# Altium project OpenFRA_V2.PrjPcb
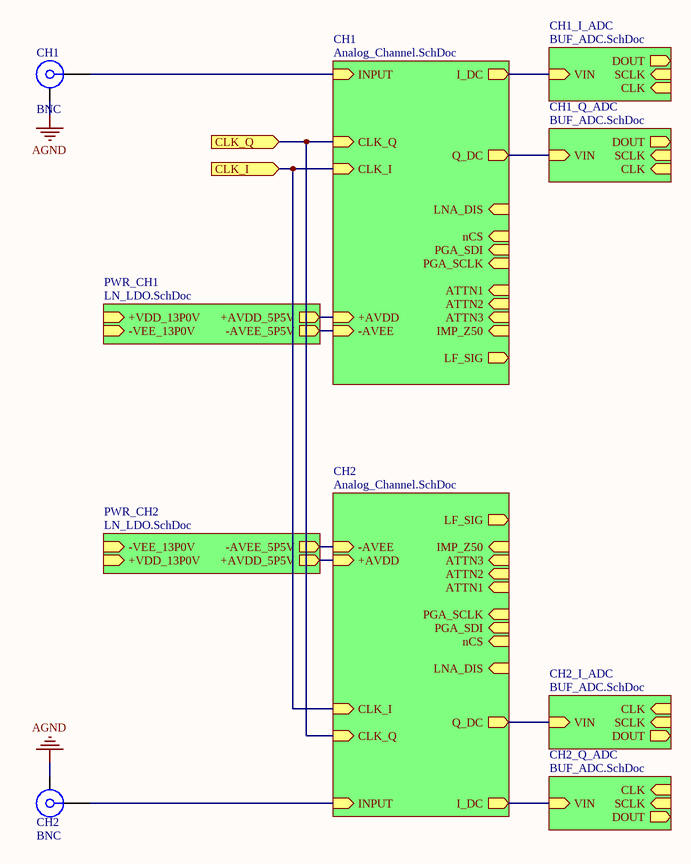
[diagram p0: Analog_Channel_Test.SchDoc]
9 sheets, 354 parts. Net scope: hierarchical (ports join the sheet entries above them; power ports are global).
Board files: PCB1.PcbDoc, PCB_AutoRoute.PcbDoc
Sheets:
  Analog_Channel_Test.SchDoc
    CH1 = Analog_Channel.SchDoc
      LNA1 = OPA847_LNA.SchDoc
      PGA1 = AD603_PGA.SchDoc
      MIXER_Q = AD834_Mixer.SchDoc
      MIXED_I = AD834_Mixer.SchDoc
      ATTN1 = Ladder_ATTN.SchDoc
    PWR_CH1 = LN_LDO.SchDoc
    CH1_I_ADC = BUF_ADC.SchDoc
    CH1_Q_ADC = BUF_ADC.SchDoc
    CH2 = Analog_Channel.SchDoc
      LNA1 = OPA847_LNA.SchDoc
      PGA1 = AD603_PGA.SchDoc
      MIXER_Q = AD834_Mixer.SchDoc
      MIXED_I = AD834_Mixer.SchDoc
      ATTN1 = Ladder_ATTN.SchDoc
    PWR_CH2 = LN_LDO.SchDoc
    CH2_Q_ADC = BUF_ADC.SchDoc
    CH2_I_ADC = BUF_ADC.SchDoc
  PCM1802_StereoADC.SchDoc

## Sheet Analog_Channel_Test.SchDoc
size A4; SheetNumber: 1; SheetTotal: 9

### Parts
CH1  BNC  [BNC-TYCO_1-1337542-0]
CH2  BNC  [BNC-TYCO_1-1337542-0]

### Sub-sheets
CH1 = Analog_Channel.SchDoc: INPUT (in), I_DC (out), Q_DC (out), CLK_Q (in), CLK_I (in), nCS (in), PGA_SDI (in), PGA_SCLK (in), LF_SIG (out), ATTN3 (in), ATTN2 (in), ATTN1 (in), IMP_Z50 (in), LNA_DIS (in), +AVDD (in), -AVEE (in)
CH1_I_ADC = BUF_ADC.SchDoc: VIN (in), CLK (in), SCLK (in), DOUT (out)
CH1_Q_ADC = BUF_ADC.SchDoc: VIN (in), CLK (in), SCLK (in), DOUT (out)
CH2 = Analog_Channel.SchDoc: INPUT (in), I_DC (out), Q_DC (out), CLK_Q (in), CLK_I (in), nCS (in), PGA_SDI (in), PGA_SCLK (in), LF_SIG (out), ATTN3 (in), ATTN2 (in), ATTN1 (in), IMP_Z50 (in), LNA_DIS (in), +AVDD (in), -AVEE (in)
CH2_I_ADC = BUF_ADC.SchDoc: VIN (in), CLK (in), SCLK (in), DOUT (out)
CH2_Q_ADC = BUF_ADC.SchDoc: VIN (in), CLK (in), SCLK (in), DOUT (out)
PWR_CH1 = LN_LDO.SchDoc: +AVDD_5P5V (out), -AVEE_5P5V (out), +VDD_13P0V (in), -VEE_13P0V (in)
PWR_CH2 = LN_LDO.SchDoc: +AVDD_5P5V (out), -AVEE_5P5V (out), +VDD_13P0V (in), -VEE_13P0V (in)

### Ports
CLK_I (in), CLK_Q (in)

### Nets
AGND: CH1.MH CH2.MH
NetC2_CH1_ATTN1_1: CH1.1 ; sheet CH1/INPUT
NetC2_CH2_ATTN1_1: CH2.1 ; sheet CH2/INPUT
NetC22_PWR_CH1_2: sheet CH1/+AVDD, sheet PWR_CH1/+AVDD_5P5V
NetC22_PWR_CH2_2: sheet CH2/+AVDD, sheet PWR_CH2/+AVDD_5P5V
NetC30_PWR_CH1_1: sheet CH1/-AVEE, sheet PWR_CH1/-AVEE_5P5V
NetC30_PWR_CH2_1: sheet CH2/-AVEE, sheet PWR_CH2/-AVEE_5P5V
NetR11_CH1_MIXED_I_1: sheet CH1/I_DC, sheet CH1_I_ADC/VIN
NetR11_CH1_MIXER_Q_1: sheet CH1/Q_DC, sheet CH1_Q_ADC/VIN
NetR11_CH2_MIXED_I_1: sheet CH2/I_DC, sheet CH2_Q_ADC/VIN
NetR11_CH2_MIXER_Q_1: sheet CH2/Q_DC, sheet CH2_I_ADC/VIN
NetU2_CH1_MIXED_I_1: port CLK_I, sheet CH1/CLK_I, sheet CH2/CLK_I
NetU2_CH1_MIXER_Q_1: port CLK_Q, sheet CH1/CLK_Q, sheet CH2/CLK_Q

### Library data of the parts
CH1 CH2 = BNC: BNC-KE PIN 6.9mm distance; PartNumber: 51K101-400A4; Design Note: Footprint in library is a generic example - only application specific footprint delivers High Performance; DatasheetVersion: c00; PackageVersion: c00; PackageReference: 51K101-400A4; PackageDescription: 50R BNC Straight Jack, 12 x 12 x 15 mm; Mounting Technology: Through Hole; ComponentLink1Description: Manufacturer URL; ComponentLink1URL: http://www.rosenberger.de; ComponentLink2Description: Datasheet; ComponentLink2URL: http://rosenberger.de/ok/images/documents/db/51K101-400A4.pdf; ComponentLink3Description: Package Specification; ComponentLink3URL: http://rosenberger.de/ok/images/documents/db/51K101-400A4.pdf; ComponentLink4Description: URL Link1; ComponentLink4URL: Series Overview / Design Note:http://rosenberger.de/ok/images/documents/spez/51.pdf; ComponentLink5Description: Webshop / RFQ; ComponentLink5URL: http://www.rosenberger.com/en/contact/sales/

## Sheet Analog_Channel.SchDoc
size A4; SheetNumber: 2; SheetTotal: 9
Used 2 times, as channels CH1, CH2. Parts and nets are listed once, with the designators drawn on the sheet.
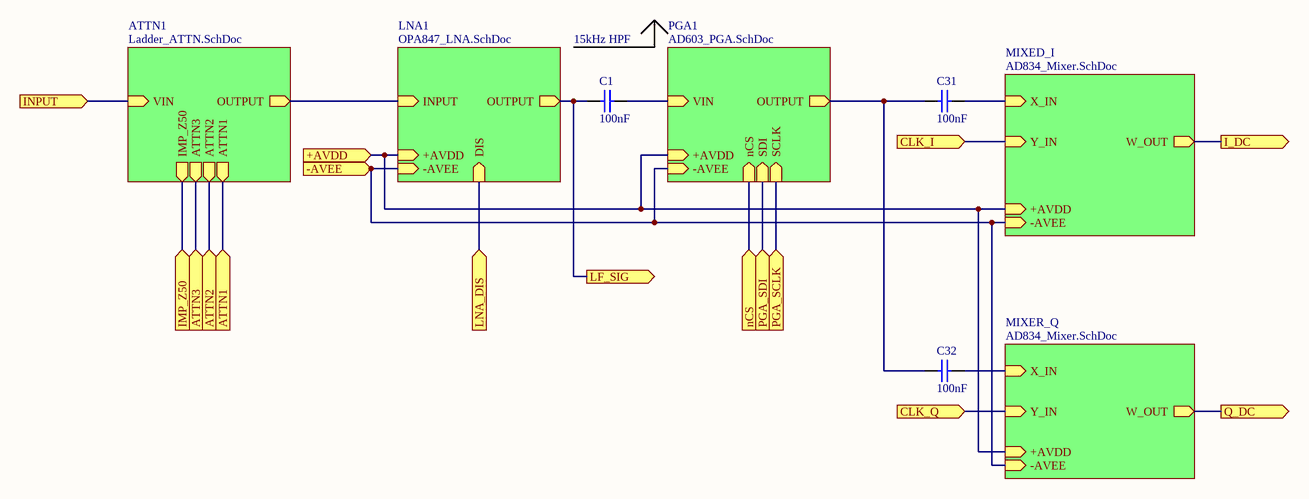
[diagram p1: Analog_Channel.SchDoc]

### Parts
C1  100nF  [0805_C]
C31  100nF  [0805_C]
C32  100nF  [0805_C]

### Sub-sheets
ATTN1 = Ladder_ATTN.SchDoc: OUTPUT (out), VIN (in), ATTN1 (out), ATTN2 (out), ATTN3 (out), IMP_Z50 (out)
LNA1 = OPA847_LNA.SchDoc: INPUT (in), OUTPUT (out), DIS (in), +AVDD (in), -AVEE (in)
MIXED_I = AD834_Mixer.SchDoc: X_IN (in), Y_IN (in), W_OUT (out), +AVDD (in), -AVEE (in)
MIXER_Q = AD834_Mixer.SchDoc: X_IN (in), Y_IN (in), W_OUT (out), +AVDD (in), -AVEE (in)
PGA1 = AD603_PGA.SchDoc: OUTPUT (out), nCS (in), SDI (in), SCLK (in), VIN (in), +AVDD (in), -AVEE (in)

### Ports
+AVDD (in), -AVEE (in), ATTN1 (in), ATTN2 (in), ATTN3 (in), CLK_I (in), CLK_Q (in), I_DC (out), IMP_Z50 (in), INPUT (in), LF_SIG (out), LNA_DIS (in), nCS (in), PGA_SCLK (in), PGA_SDI (in), Q_DC (out)

### Nets
+AVDD: port +AVDD, sheet LNA1/+AVDD, sheet PGA1/+AVDD, sheet MIXER_Q/+AVDD, sheet MIXED_I/+AVDD
-AVEE: port -AVEE, sheet LNA1/-AVEE, sheet PGA1/-AVEE, sheet MIXER_Q/-AVEE, sheet MIXED_I/-AVEE
ATTN1: port ATTN1, sheet ATTN1/ATTN1
ATTN2: port ATTN2, sheet ATTN1/ATTN2
ATTN3: port ATTN3, sheet ATTN1/ATTN3
CLK_I: port CLK_I, sheet MIXED_I/Y_IN
CLK_Q: port CLK_Q, sheet MIXER_Q/Y_IN
I_DC: port I_DC, sheet MIXED_I/W_OUT
IMP_Z50: port IMP_Z50, sheet ATTN1/IMP_Z50
INPUT: port INPUT, sheet ATTN1/VIN
LF_SIG: C1.1 ; port LF_SIG, sheet LNA1/OUTPUT
LNA_DIS: port LNA_DIS, sheet LNA1/DIS
nCS: port nCS, sheet PGA1/nCS
PGA_SCLK: port PGA_SCLK, sheet PGA1/SCLK
PGA_SDI: port PGA_SDI, sheet PGA1/SDI
Q_DC: port Q_DC, sheet MIXER_Q/W_OUT
NetC1_2: C1.2 ; sheet PGA1/VIN
NetC31_1: C31.1 C32.1 ; sheet PGA1/OUTPUT
NetC31_2: C31.2 ; sheet MIXED_I/X_IN
NetC32_2: C32.2 ; sheet MIXER_Q/X_IN
(unnamed): sheet LNA1/INPUT, sheet ATTN1/OUTPUT

### Channels
CH1: designators end in _CH1; ports +AVDD=NetC22_PWR_CH1_2 -AVEE=NetC30_PWR_CH1_1 ATTN1=NetD1_CH1_ATTN1_1 ATTN2=NetD2_CH1_ATTN1_1 ATTN3=NetD3_CH1_ATTN1_1 CLK_I=NetU2_CH1_MIXED_I_1 CLK_Q=NetU2_CH1_MIXER_Q_1 I_DC=NetR11_CH1_MIXED_I_1 IMP_Z50=NetD4_CH1_ATTN1_1 INPUT=NetC2_CH1_ATTN1_1 LF_SIG=NetC1_CH1_1 LNA_DIS=NetQ1_CH1_LNA1_1 nCS=NetR36_CH1_PGA1_1 PGA_SCLK=NetR38_CH1_PGA1_1 PGA_SDI=NetR37_CH1_PGA1_1 Q_DC=NetR11_CH1_MIXER_Q_1
CH2: designators end in _CH2; ports +AVDD=NetC22_PWR_CH2_2 -AVEE=NetC30_PWR_CH2_1 ATTN1=NetD1_CH2_ATTN1_1 ATTN2=NetD2_CH2_ATTN1_1 ATTN3=NetD3_CH2_ATTN1_1 CLK_I=NetU2_CH1_MIXED_I_1 CLK_Q=NetU2_CH1_MIXER_Q_1 I_DC=NetR11_CH2_MIXED_I_1 IMP_Z50=NetD4_CH2_ATTN1_1 INPUT=NetC2_CH2_ATTN1_1 LF_SIG=NetC1_CH2_1 LNA_DIS=NetQ1_CH2_LNA1_1 nCS=NetR36_CH2_PGA1_1 PGA_SCLK=NetR38_CH2_PGA1_1 PGA_SDI=NetR37_CH2_PGA1_1 Q_DC=NetR11_CH2_MIXER_Q_1

### Notes on the sheet
- 15kHz HPF

### Library data of the parts
C1 C31 C32 = 0805 100nF(104) 10% 50V: 贴片电容; ComponentLink1Description: 供应商链接; ComponentLink1URL: http://www.szlcsc.com/product/details_50686.html; Package: 0805; Supplier: LC; SuppliersPartNumber: C49678

## Sheet OPA847_LNA.SchDoc
size A4; SheetNumber: 3; SheetTotal: 9
Used 2 times, as channels CH1/LNA1, CH2/LNA1. Parts and nets are listed once, with the designators drawn on the sheet.
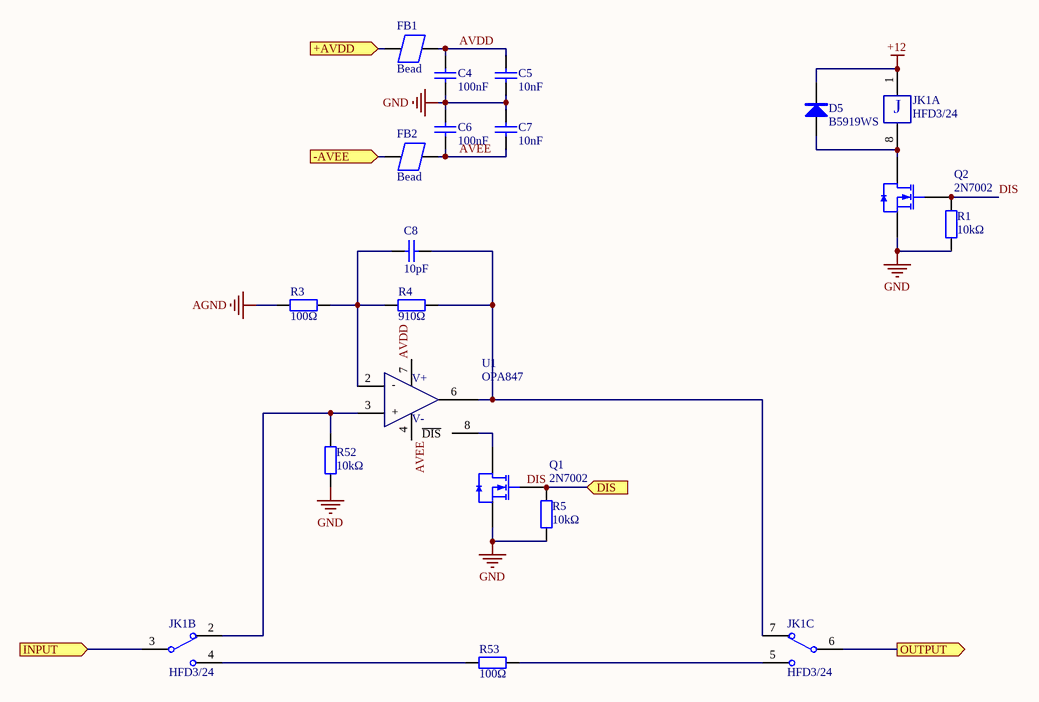
[diagram p2: OPA847_LNA.SchDoc]

### Parts
C4  100nF  [0603_C]
C5  10nF  [0603_C]
C6  100nF  [0603_C]
C7  10nF  [0603_C]
C8  10pF  [0603_C]
D5  B5919WS  [SOD-323]
FB1  Bead  [0805_L]
FB2  Bead  [0805_L]
JK1  HFD3/24  [HFD3-DIP]  (parts A,B,C of 3)
Q1  2N7002  [SOT-23(SOT-23-3)]
Q2  2N7002  [SOT-23(SOT-23-3)]
R1  10kΩ  [0603_R]
R3  100Ω  [0603_R]
R4  910Ω  [0603_R]
R5  10kΩ  [0603_R]
R52  10kΩ  [0603_R]
R53  100Ω  [0603_R]
U1  OPA847  [SOIC127P600X175-8M]

### Ports
+AVDD (in), -AVEE (in), DIS (in), INPUT (in), OUTPUT (out)

### Nets
+12: D5.2(K) JK1.1
AGND: R3.1
GND: C4.1 C5.1 C6.1 C7.1 Q1.2(S) Q2.2(S) R1.1 R5.1 R52.1
+AVDD: FB1.1 ; port +AVDD
-AVEE: FB2.1 ; port -AVEE
AVDD: C4.2 C5.2 FB1.2 U1.7(VCC+)
AVEE: C6.2 C7.2 FB2.2 U1.4(VCC-)
DIS: Q1.1(G) R5.2 ; port DIS
DIS: Q2.1(G) R1.2  [a separate net that carries the same name]
INPUT: JK1.3 ; port INPUT
OUTPUT: JK1.6 ; port OUTPUT
NetC8_1: C8.1 R3.2 R4.1 U1.2
NetC8_2: C8.2 JK1.7 R4.2 U1.6
NetD5_1: D5.1(A) JK1.8 Q2.3(D)
NetJK1_2: JK1.2 R52.2 U1.3
NetJK1_4: JK1.4 R53.2
NetJK1_5: JK1.5 R53.1
NetQ1_3: Q1.3(D) U1.8(~{DIS})

### Channels
CH1/LNA1: designators end in _CH1_LNA1; ports +AVDD=NetC22_PWR_CH1_2 -AVEE=NetC30_PWR_CH1_1 DIS=NetQ1_CH1_LNA1_1 INPUT=NetJK1_CH1_LNA1_3 OUTPUT=NetC1_CH1_1
CH2/LNA1: designators end in _CH2_LNA1; ports +AVDD=NetC22_PWR_CH2_2 -AVEE=NetC30_PWR_CH2_1 DIS=NetQ1_CH2_LNA1_1 INPUT=NetJK1_CH2_LNA1_3 OUTPUT=NetC1_CH2_1

### Notes on the sheet
- Labels drawn without touching a wire or pin: DIS
- (in symbol HFD3, part A) J
- (in symbol OPA847) V+; -; +; V-

### Library data of the parts
C4 C6 = 0603 100nF (104) 10% 50V: 贴片电容; ComponentLink1Description: 供应商链接; ComponentLink1URL: http://www.szlcsc.com/product/details_15331.html; Package: 0603; Supplier: LC; SuppliersPartNumber: C14663
C5 C7 = 0603 10nF (103) 10% 50V: 贴片电容; ComponentLink1Description: 供应商链接; ComponentLink1URL: http://www.szlcsc.com/product/details_58143.html; Package: 0603; Supplier: LC; SuppliersPartNumber: C57112
C8 = 0603 10pF (100) 5% 50V: 贴片电容; ComponentLink1Description: 供应商链接; ComponentLink1URL: http://www.szlcsc.com/product/details_1986.html; Package: 0603; Supplier: LC; SuppliersPartNumber: C1634
D5 = 1N5819: 肖特基二极管; 版权归属: 源创客; 属性: 40V/2A; BOM名称: 肖特基二极管; 学习资源: www.ooocke.com
JK1 = HFD3: 超小型两组转换; BOM名称: 两组转换继电器; 版权归属: 源创客; 学习资源: www.ooocke.com
Q1 Q2 = 2N7002 7002: MOS(场效应管); ComponentLink1Description: 供应商链接; ComponentLink1URL: http://www.szlcsc.com/product/details_9040.html; Package: SOT-23(SOT-23-3); Supplier: LC; SuppliersPartNumber: C8545
R1 R5 = 0603 10KΩ (1002) 1%: 贴片电阻; ComponentLink1Description: 供应商链接; ComponentLink1URL: http://www.szlcsc.com/product/details_26547.html; Package: 0603; Supplier: LC; SuppliersPartNumber: C25804
R3 R52 R53 = 0603 100Ω (1000) 1%: 贴片电阻; ComponentLink1Description: 供应商链接; ComponentLink1URL: http://www.szlcsc.com/product/details_23502.html; Package: 0603; Supplier: LC; SuppliersPartNumber: C22775
R4 = 0603 910Ω (9100) 1%: 贴片电阻; ComponentLink1Description: 供应商链接; ComponentLink1URL: http://www.szlcsc.com/product/details_23991.html; Package: 0603; Supplier: LC; SuppliersPartNumber: C23264
U1 = OPA847: Wideband, Ultra-Low Noise, Voltage-Feedback OPERATIONAL AMPLIFIER with Shutdown

## Sheet AD603_PGA.SchDoc
size A4; SheetNumber: 5; SheetTotal: 9
Used 2 times, as channels CH1/PGA1, CH2/PGA1. Parts and nets are listed once, with the designators drawn on the sheet.
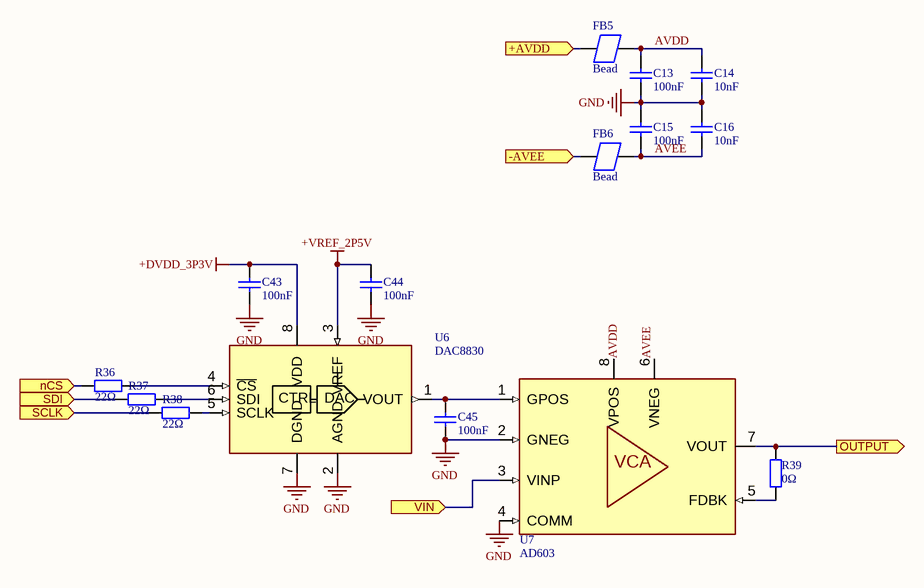
[diagram p3: AD603_PGA.SchDoc]

### Parts
C13  100nF  [0603_C]
C14  10nF  [0603_C]
C15  100nF  [0603_C]
C16  10nF  [0603_C]
C43  100nF  [0603_C]
C44  100nF  [0603_C]
C45  100nF  [0603_C]
FB5  Bead  [0805_L]
FB6  Bead  [0805_L]
R36  22Ω  [0603_R]
R37  22Ω  [0603_R]
R38  22Ω  [0603_R]
R39  0Ω  [0603_R]
U6  DAC8830  [SOIC127P600X175-8M]
U7  AD603  [SOIC127P600X175-8M]

### Ports
+AVDD (in), -AVEE (in), nCS (in), OUTPUT (out), SCLK (in), SDI (in), VIN (in)

### Nets
+DVDD_3P3V: C43.2 U6.8(VDD)
+VREF_2P5V: C44.2 U6.3(VREF)
GND: C13.1 C14.1 C15.1 C16.1 C43.1 C44.1 C45.1 U6.2(AGND) U6.7(DGND) U7.2(GNEG) U7.4(COMM)
+AVDD: FB5.1 ; port +AVDD
-AVEE: FB6.1 ; port -AVEE
AVDD: C13.2 C14.2 FB5.2
AVEE: C15.2 C16.2 FB6.2 U7.6(VNEG)
nCS: R36.1 ; port nCS
OUTPUT: R39.2 U7.7(VOUT) ; port OUTPUT
SCLK: R38.1 ; port SCLK
SDI: R37.1 ; port SDI
VIN: U7.3(VINP) ; port VIN
NetC45_2: C45.2 U6.1(VOUT) U7.1(GPOS)
NetR36_2: R36.2 U6.4(~{CS})
NetR37_2: R37.2 U6.6(SDI)
NetR38_2: R38.2 U6.5(SCLK)
NetR39_1: R39.1 U7.5(FDBK)

Not connected (* = marked no-connect by the designer): U7 8(VPOS)

### Channels
CH1/PGA1: designators end in _CH1_PGA1; ports +AVDD=NetC22_PWR_CH1_2 -AVEE=NetC30_PWR_CH1_1 nCS=NetR36_CH1_PGA1_1 OUTPUT=NetC31_CH1_1 SCLK=NetR38_CH1_PGA1_1 SDI=NetR37_CH1_PGA1_1 VIN=NetC1_CH1_2
CH2/PGA1: designators end in _CH2_PGA1; ports +AVDD=NetC22_PWR_CH2_2 -AVEE=NetC30_PWR_CH2_1 nCS=NetR36_CH2_PGA1_1 OUTPUT=NetC31_CH2_1 SCLK=NetR38_CH2_PGA1_1 SDI=NetR37_CH2_PGA1_1 VIN=NetC1_CH2_2

### Notes on the sheet
- Labels drawn without touching a wire or pin: AVDD
- (in symbol AD603) VCA
- (in symbol DAC8830) CTRL; DAC

### Library data of the parts
C13 C15 C43-C45 = 0603 100nF (104) 10% 50V: 贴片电容; ComponentLink1Description: 供应商链接; ComponentLink1URL: http://www.szlcsc.com/product/details_15331.html; Package: 0603; Supplier: LC; SuppliersPartNumber: C14663
C14 C16 = 0603 10nF (103) 10% 50V: 贴片电容; ComponentLink1Description: 供应商链接; ComponentLink1URL: http://www.szlcsc.com/product/details_58143.html; Package: 0603; Supplier: LC; SuppliersPartNumber: C57112
R36-R38 = 0603 22Ω (22R0) 1%: 贴片电阻; ComponentLink1Description: 供应商链接; ComponentLink1URL: http://www.szlcsc.com/product/details_24078.html; Package: 0603; Supplier: LC; SuppliersPartNumber: C23345
R39 = 0603 0Ω (0R0) 1%: 贴片电阻; ComponentLink1Description: 供应商链接; ComponentLink1URL: http://www.szlcsc.com/product/details_21903.html; Package: 0603; Supplier: LC; SuppliersPartNumber: C21189

## Sheet AD834_Mixer.SchDoc
size A4; SheetNumber: 4; SheetTotal: 9
Used 4 times, as channels CH1/MIXER_Q, CH1/MIXED_I, CH2/MIXER_Q, CH2/MIXED_I. Parts and nets are listed once, with the designators drawn on the sheet.
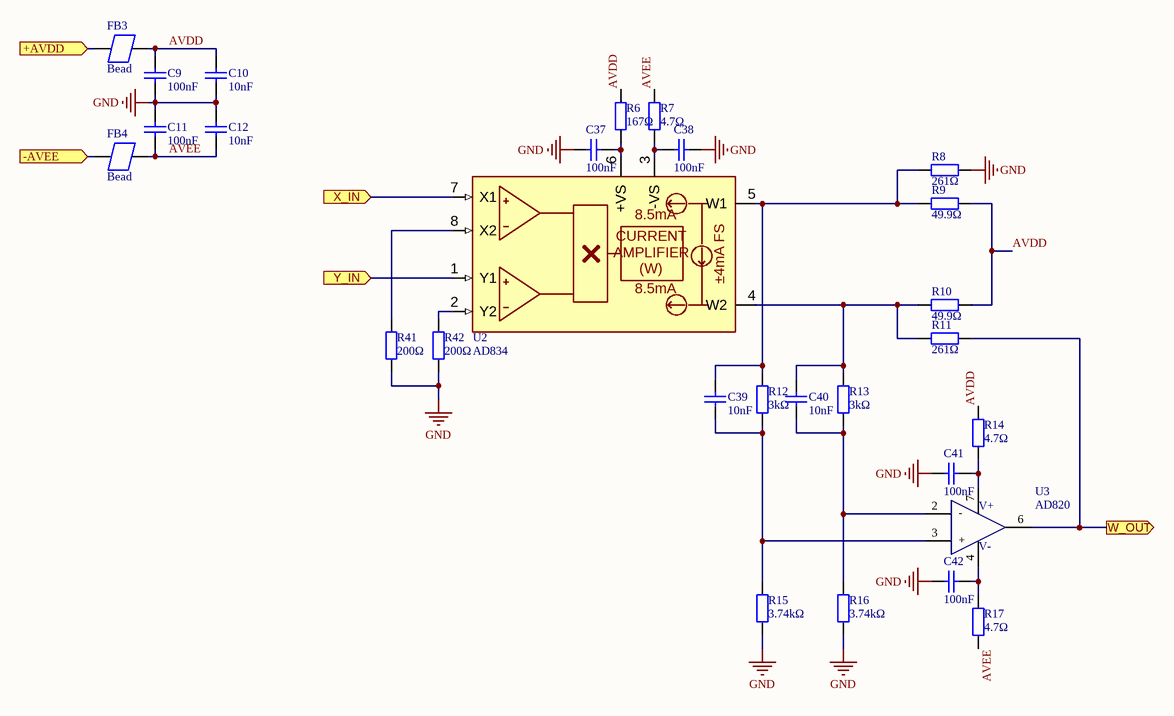
[diagram p4: AD834_Mixer.SchDoc]

### Parts
C9  100nF  [0603_C]
C10  10nF  [0603_C]
C11  100nF  [0603_C]
C12  10nF  [0603_C]
C37  100nF  [0603_C]
C38  100nF  [0603_C]
C39  10nF  [0603_C]
C40  10nF  [0603_C]
C41  100nF  [0603_C]
C42  100nF  [0603_C]
FB3  Bead  [0805_L]
FB4  Bead  [0805_L]
R6  167Ω  [0603_R]
R7  4.7Ω  [0603_R]
R8  261Ω  [0603_R]
R9  49.9Ω  [0603_R]
R10  49.9Ω  [0603_R]
R11  261Ω  [0603_R]
R12  3kΩ  [0603_R]
R13  3kΩ  [0603_R]
R14  4.7Ω  [0603_R]
R15  3.74kΩ  [0603_R]
R16  3.74kΩ  [0603_R]
R17  4.7Ω  [0603_R]
R41  200Ω  [0603_R]
R42  200Ω  [0603_R]
U2  AD834  [SOIC127P600X175-8M]
U3  AD820  [SOIC127P600X175-8M]

### Ports
+AVDD (in), -AVEE (in), W_OUT (out), X_IN (in), Y_IN (in)

### Nets
GND: C9.1 C10.1 C11.1 C12.1 C37.1 C38.1 C41.2 C42.2 R8.1 R15.1 R16.1 R41.1 R42.1
+AVDD: FB3.1 ; port +AVDD
-AVEE: FB4.1 ; port -AVEE
AVDD: C9.2 C10.2 FB3.2 R6.1 R9.1 R10.1 R14.1
AVEE: C11.2 C12.2 FB4.2 R7.1 R17.2
W_OUT: R11.1 U3.6 ; port W_OUT
X_IN: U2.7(X1) ; port X_IN
Y_IN: U2.1(Y1) ; port Y_IN
NetC37_2: C37.2 R6.2 U2.6(+VS)
NetC38_2: C38.2 R7.2 U2.3(-VS)
NetC39_1: C39.1 R12.1 R15.2 U3.3
NetC39_2: C39.2 R8.2 R9.2 R12.2 U2.5(W1)
NetC40_1: C40.1 R13.1 R16.2 U3.2
NetC40_2: C40.2 R10.2 R11.2 R13.2 U2.4(W2)
NetC41_1: C41.1 R14.2 U3.7(VCC+)
NetC42_1: C42.1 R17.1 U3.4(VCC-)
NetR41_2: R41.2 U2.8(X2)
NetR42_2: R42.2 U2.2(Y2)

### Channels
CH1/MIXER_Q: designators end in _CH1_MIXER_Q; ports +AVDD=NetC22_PWR_CH1_2 -AVEE=NetC30_PWR_CH1_1 W_OUT=NetR11_CH1_MIXER_Q_1 X_IN=NetC32_CH1_2 Y_IN=NetU2_CH1_MIXER_Q_1
CH1/MIXED_I: designators end in _CH1_MIXED_I; ports +AVDD=NetC22_PWR_CH1_2 -AVEE=NetC30_PWR_CH1_1 W_OUT=NetR11_CH1_MIXED_I_1 X_IN=NetC31_CH1_2 Y_IN=NetU2_CH1_MIXED_I_1
CH2/MIXER_Q: designators end in _CH2_MIXER_Q; ports +AVDD=NetC22_PWR_CH2_2 -AVEE=NetC30_PWR_CH2_1 W_OUT=NetR11_CH2_MIXER_Q_1 X_IN=NetC32_CH2_2 Y_IN=NetU2_CH1_MIXER_Q_1
CH2/MIXED_I: designators end in _CH2_MIXED_I; ports +AVDD=NetC22_PWR_CH2_2 -AVEE=NetC30_PWR_CH2_1 W_OUT=NetR11_CH2_MIXED_I_1 X_IN=NetC31_CH2_2 Y_IN=NetU2_CH1_MIXED_I_1

### Notes on the sheet
- (in symbol AD834) 8.5mA; CURRENT / AMPLIFIER / (W); ±4mA FS
- (in symbol OPA189) V+; -; +; V-

### Library data of the parts
C9 C11 C37 C38 C41 C42 = 0603 100nF (104) 10% 50V: 贴片电容; ComponentLink1Description: 供应商链接; ComponentLink1URL: http://www.szlcsc.com/product/details_15331.html; Package: 0603; Supplier: LC; SuppliersPartNumber: C14663
C10 C12 C39 C40 = 0603 10nF (103) 10% 50V: 贴片电容; ComponentLink1Description: 供应商链接; ComponentLink1URL: http://www.szlcsc.com/product/details_58143.html; Package: 0603; Supplier: LC; SuppliersPartNumber: C57112
R6-R11 R14 R17 = 0603 49.9Ω (49R9) 1%: 贴片电阻; ComponentLink1Description: 供应商链接; ComponentLink1URL: http://www.szlcsc.com/product/details_23912.html; Package: 0603; Supplier: LC; SuppliersPartNumber: C23185
R12 R13 R15 R16 = 0603 3KΩ (3001) 1%: 贴片电阻; ComponentLink1Description: 供应商链接; ComponentLink1URL: http://www.szlcsc.com/product/details_4618.html; Package: 0603; Supplier: LC; SuppliersPartNumber: C4211
R41 R42 = 0603 200Ω (2000) 1%: 贴片电阻; ComponentLink1Description: 供应商链接; ComponentLink1URL: http://www.szlcsc.com/product/details_8708.html; Package: 0603; Supplier: LC; SuppliersPartNumber: C8218
U3 = OPA189: 单路、14MHz、多路复用器友好型、低噪声、零漂移、RRO、CMOS 精密运算放大器

## Sheet Ladder_ATTN.SchDoc
size A4; SheetNumber: 6; SheetTotal: 9
Used 2 times, as channels CH1/ATTN1, CH2/ATTN1. Parts and nets are listed once, with the designators drawn on the sheet.
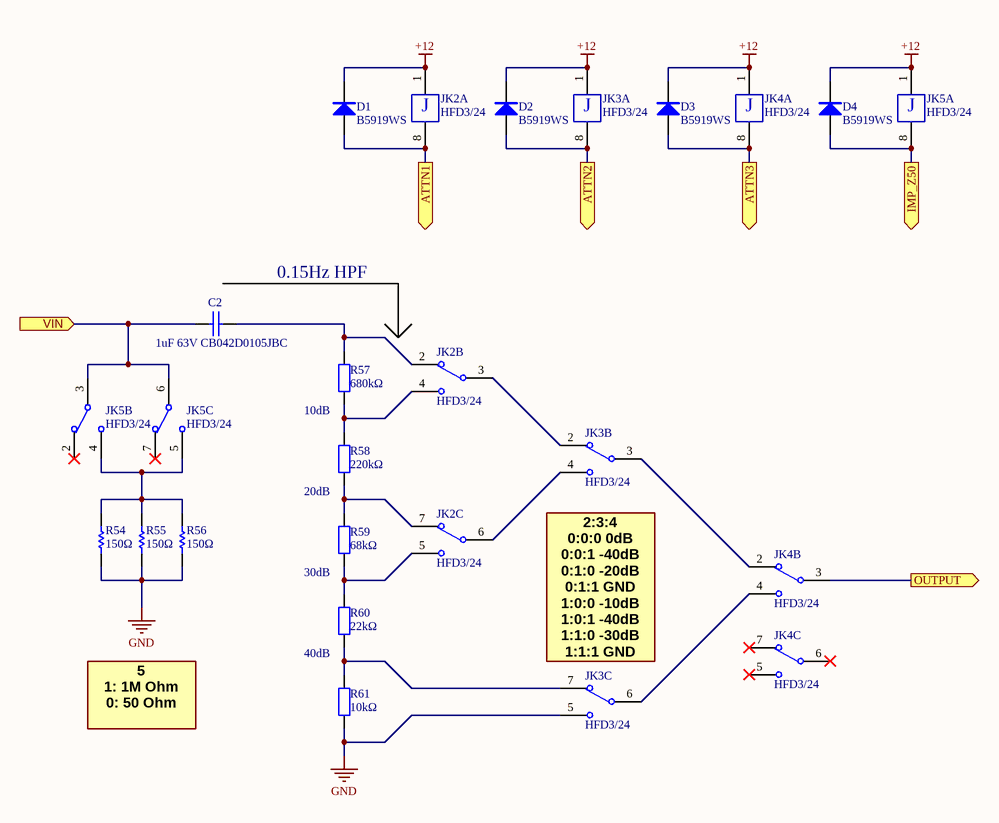
[diagram p5: Ladder_ATTN.SchDoc]

### Parts
C2  1uF 63V CB042D0105JBC  [2225C]
D1  B5919WS  [SOD-323]
D2  B5919WS  [SOD-323]
D3  B5919WS  [SOD-323]
D4  B5919WS  [SOD-323]
JK2  HFD3/24  [HFD3-DIP]  (parts A,B,C of 3)
JK3  HFD3/24  [HFD3-DIP]  (parts A,B,C of 3)
JK4  HFD3/24  [HFD3-DIP]  (parts A,B,C of 3)
JK5  HFD3/24  [HFD3-DIP]  (parts A,B,C of 3)
R54  150Ω  [2512R]
R55  150Ω  [2512R]
R56  150Ω  [2512R]
R57  680kΩ  [0603_R]
R58  220kΩ  [0603_R]
R59  68kΩ  [0603_R]
R60  22kΩ  [0603_R]
R61  10kΩ  [0603_R]

### Ports
ATTN1 (out), ATTN2 (out), ATTN3 (out), IMP_Z50 (out), OUTPUT (out), VIN (in)

### Nets
+12: D1.2(K) D2.2(K) D3.2(K) D4.2(K) JK2.1 JK3.1 JK4.1 JK5.1
GND: JK3.5 R54.1 R55.1 R56.1 R61.1
ATTN1: D1.1(A) JK2.8 ; port ATTN1
ATTN2: D2.1(A) JK3.8 ; port ATTN2
ATTN3: D3.1(A) JK4.8 ; port ATTN3
IMP_Z50: D4.1(A) JK5.8 ; port IMP_Z50
OUTPUT: JK4.3 ; port OUTPUT
VIN: C2.1 JK5.3 JK5.6 ; port VIN
NetC2_2: C2.2 JK2.2 R57.2
NetJK2_3: JK2.3 JK3.2
NetJK2_4: JK2.4 R57.1 R58.2
NetJK2_5: JK2.5 R59.1 R60.2
NetJK2_6: JK2.6 JK3.4
NetJK2_7: JK2.7 R58.1 R59.2
NetJK3_3: JK3.3 JK4.2
NetJK3_6: JK3.6 JK4.4
NetJK3_7: JK3.7 R60.1 R61.2
NetJK5_4: JK5.4 JK5.5 R54.2 R55.2 R56.2

Not connected (* = marked no-connect by the designer): JK4 5* 6* 7*; JK5 2* 7*

### Channels
CH1/ATTN1: designators end in _CH1_ATTN1; ports ATTN1=NetD1_CH1_ATTN1_1 ATTN2=NetD2_CH1_ATTN1_1 ATTN3=NetD3_CH1_ATTN1_1 IMP_Z50=NetD4_CH1_ATTN1_1 OUTPUT=NetJK1_CH1_LNA1_3 VIN=NetC2_CH1_ATTN1_1
CH2/ATTN1: designators end in _CH2_ATTN1; ports ATTN1=NetD1_CH2_ATTN1_1 ATTN2=NetD2_CH2_ATTN1_1 ATTN3=NetD3_CH2_ATTN1_1 IMP_Z50=NetD4_CH2_ATTN1_1 OUTPUT=NetJK1_CH2_LNA1_3 VIN=NetC2_CH2_ATTN1_1

### Notes on the sheet
- 0.15Hz HPF
- 10dB
- 20dB
- 30dB
- 40dB
- (near JK3) 2:3:4
  0:0:0 0dB
  0:0:1 -40dB
  0:1:0 -20dB
  0:1:1 GND
  1:0:0 -10dB
  1:0:1 -40dB
  1:1:0 -30dB
  1:1:1 GND
- 5
  1: 1M Ohm
  0: 50 Ohm
- (in symbol HFD3, part A) J

### Library data of the parts
C2 = CAP: 无极性电容
D1-D4 = 1N5819: 肖特基二极管; 版权归属: 源创客; 属性: 40V/2A; BOM名称: 肖特基二极管; 学习资源: www.ooocke.com
JK2-JK5 = HFD3: 超小型两组转换; BOM名称: 两组转换继电器; 版权归属: 源创客; 学习资源: www.ooocke.com
R54-R56 = RES
R57 R59 = 0603 680KΩ (6803) 1%: 贴片电阻; ComponentLink1Description: 供应商链接; ComponentLink1URL: http://www.szlcsc.com/product/details_26565.html; Package: 0603; Supplier: LC; SuppliersPartNumber: C25822
R58 R60 R61 = 0603 220KΩ (2203) 1%: 贴片电阻; ComponentLink1Description: 供应商链接; ComponentLink1URL: http://www.szlcsc.com/product/details_23688.html; Package: 0603; Supplier: LC; SuppliersPartNumber: C22961

## Sheet LN_LDO.SchDoc
size A4; SheetNumber: 7; SheetTotal: 9
Used 2 times, as channels PWR_CH1, PWR_CH2. Parts and nets are listed once, with the designators drawn on the sheet.
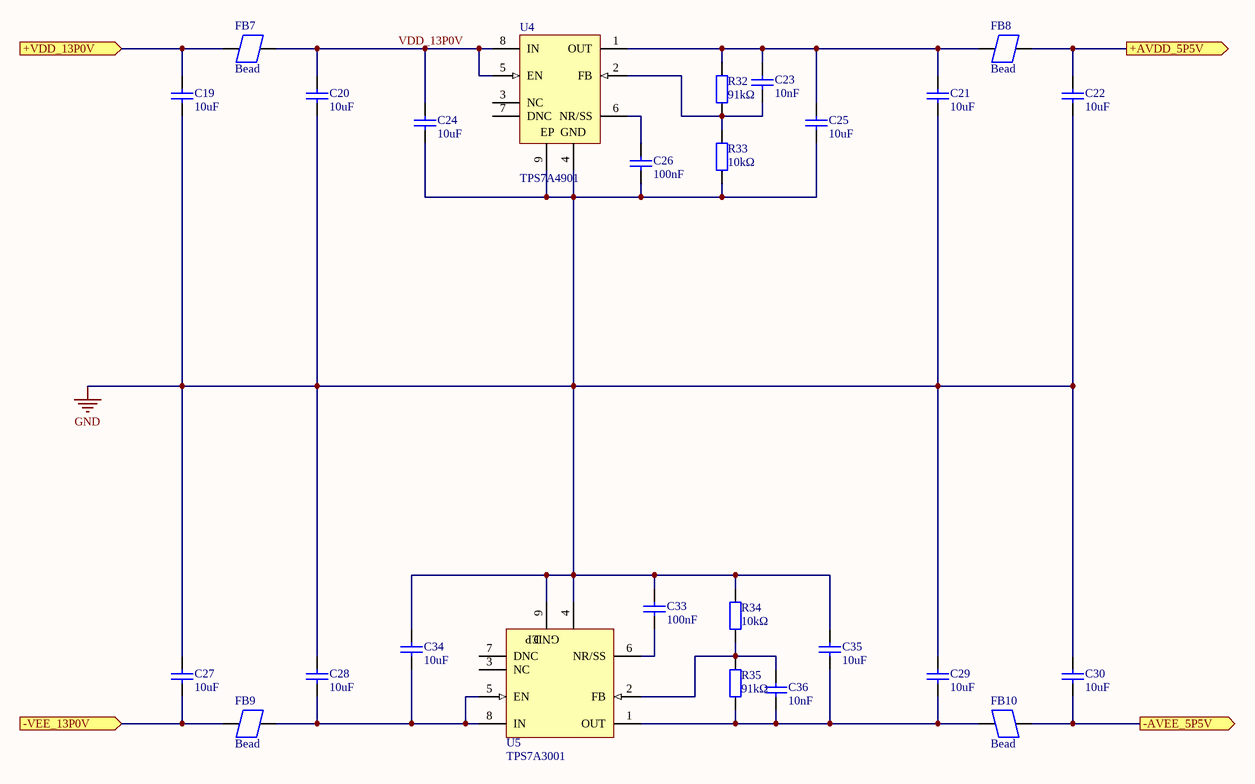
[diagram p6: LN_LDO.SchDoc]

### Parts
C19  10uF  [0805_C]
C20  10uF  [0805_C]
C21  10uF  [0805_C]
C22  10uF  [0805_C]
C23  10nF  [0603_C]
C24  10uF  [0805_C]
C25  10uF  [0805_C]
C26  100nF  [0603_C]
C27  10uF  [0805_C]
C28  10uF  [0805_C]
C29  10uF  [0805_C]
C30  10uF  [0805_C]
C33  100nF  [0603_C]
C34  10uF  [0805_C]
C35  10uF  [0805_C]
C36  10nF  [0603_C]
FB7  Bead  [0805_L]
FB8  Bead  [0805_L]
FB9  Bead  [0805_L]
FB10  Bead  [0805_L]
R32  91kΩ  [0603_R]
R33  10kΩ  [0603_R]
R34  10kΩ  [0603_R]
R35  91kΩ  [0603_R]
U4  TPS7A4901  [DGN0008D_L]
U5  TPS7A3001  [DGN0008D_L]

### Ports
+AVDD_5P5V (out), +VDD_13P0V (in), -AVEE_5P5V (out), -VEE_13P0V (in)

### Nets
GND: C19.1 C20.1 C21.1 C22.1 C24.1 C25.1 C26.1 C27.2 C28.2 C29.2 C30.2 C33.1 C34.1 C35.1 R33.1 R34.1 U4.4(GND) U4.9(EP) U5.4(GND) U5.9(EP)
+AVDD_5P5V: C22.2 FB8.1 ; port +AVDD_5P5V
+VDD_13P0V: C19.2 FB7.2 ; port +VDD_13P0V
-AVEE_5P5V: C30.1 FB10.1 ; port -AVEE_5P5V
-VEE_13P0V: C27.1 FB9.1 ; port -VEE_13P0V
VDD_13P0V: C20.2 C24.2 FB7.1 U4.5(EN) U4.8(IN)
NetC21_2: C21.2 C23.2 C25.2 FB8.2 R32.2 U4.1(OUT)
NetC23_1: C23.1 R32.1 R33.2 U4.2(FB)
NetC26_2: C26.2 U4.6(NR/SS)
NetC28_1: C28.1 C34.2 FB9.2 U5.5(EN) U5.8(IN)
NetC29_1: C29.1 C35.2 C36.2 FB10.2 R35.2 U5.1(OUT)
NetC33_2: C33.2 U5.6(NR/SS)
NetC36_1: C36.1 R34.2 R35.1 U5.2(FB)

Not connected (* = marked no-connect by the designer): U4 3(NC) 7(DNC); U5 3(NC) 7(DNC)

### Channels
PWR_CH1: designators end in _PWR_CH1; ports +AVDD_5P5V=NetC22_PWR_CH1_2 +VDD_13P0V=NetC19_PWR_CH1_2 -AVEE_5P5V=NetC30_PWR_CH1_1 -VEE_13P0V=NetC27_PWR_CH1_1
PWR_CH2: designators end in _PWR_CH2; ports +AVDD_5P5V=NetC22_PWR_CH2_2 +VDD_13P0V=NetC19_PWR_CH2_2 -AVEE_5P5V=NetC30_PWR_CH2_1 -VEE_13P0V=NetC27_PWR_CH2_1

### Library data of the parts
C19-C22 C24 C25 C27-C30 C34 C35 = 0805 10uF (106) 10% 25V: 贴片电容; ComponentLink1Description: 供应商链接; ComponentLink1URL: http://www.szlcsc.com/product/details_16532.html; Package: 0805; Supplier: LC; SuppliersPartNumber: C15850
C23 C36 = 0603 10nF (103) 10% 50V: 贴片电容; ComponentLink1Description: 供应商链接; ComponentLink1URL: http://www.szlcsc.com/product/details_58143.html; Package: 0603; Supplier: LC; SuppliersPartNumber: C57112
C26 C33 = 0603 100nF (104) 10% 50V: 贴片电容; ComponentLink1Description: 供应商链接; ComponentLink1URL: http://www.szlcsc.com/product/details_15331.html; Package: 0603; Supplier: LC; SuppliersPartNumber: C14663
R32 R35 = 0603 91KΩ (9102) 1%: 贴片电阻; ComponentLink1Description: 供应商链接; ComponentLink1URL: http://www.szlcsc.com/product/details_23992.html; Package: 0603; Supplier: LC; SuppliersPartNumber: C23265
R33 R34 = 0603 10KΩ (1002) 1%: 贴片电阻; ComponentLink1Description: 供应商链接; ComponentLink1URL: http://www.szlcsc.com/product/details_26547.html; Package: 0603; Supplier: LC; SuppliersPartNumber: C25804

## Sheet BUF_ADC.SchDoc
size A4; SheetNumber: 8; SheetTotal: 9
Used 4 times, as channels CH1_I_ADC, CH1_Q_ADC, CH2_Q_ADC, CH2_I_ADC. Parts and nets are listed once, with the designators drawn on the sheet.
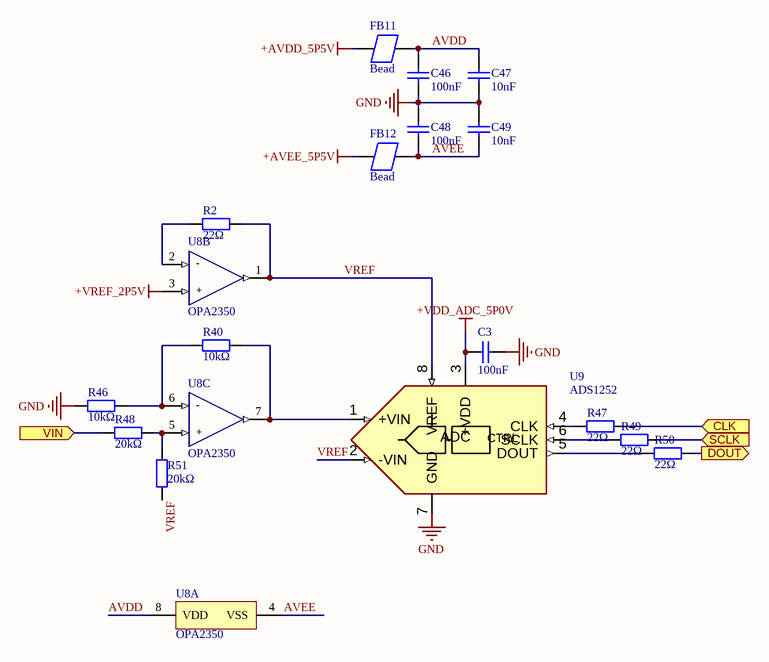
[diagram p7: BUF_ADC.SchDoc]

### Parts
C3  100nF  [0603_C]
C46  100nF  [0603_C]
C47  10nF  [0603_C]
C48  100nF  [0603_C]
C49  10nF  [0603_C]
FB11  Bead  [0805_L]
FB12  Bead  [0805_L]
R2  22Ω  [0603_R]
R40  10kΩ  [0603_R]
R46  10kΩ  [0603_R]
R47  22Ω  [0603_R]
R48  20kΩ  [0603_R]
R49  22Ω  [0603_R]
R50  22Ω  [0603_R]
R51  20kΩ  [0603_R]
U8  OPA2350  [SOIC127P600X175-8M]  (parts A,B,C of 3)
U9  ADS1252  [SOIC127P600X175-8M]

### Ports
CLK (in), DOUT (out), SCLK (in), VIN (in)

### Nets
+AVDD_5P5V: FB11.1
+AVEE_5P5V: FB12.1
+VDD_ADC_5P0V: C3.1 U9.3(+VDD)
+VREF_2P5V: U8.3(+INA)
GND: C3.2 C46.1 C47.1 C48.1 C49.1 R46.1 U9.7(GND)
AVDD: C46.2 C47.2 FB11.2 U8.8(VDD)
AVEE: C48.2 C49.2 FB12.2 U8.4(VSS)
CLK: R47.2 ; port CLK
DOUT: R50.2 ; port DOUT
SCLK: R49.2 ; port SCLK
VIN: R48.1 ; port VIN
VREF: R2.2 R51.2 U8.1(OUTA) U9.2(-VIN) U9.8(VREF)
NetR2_1: R2.1 U8.2(-INA)
NetR40_1: R40.1 R46.2 U8.6(-INB)
NetR40_2: R40.2 U8.7(OUTB) U9.1(+VIN)
NetR47_1: R47.1 U9.4(CLK)
NetR48_2: R48.2 R51.1 U8.5(+INB)
NetR49_1: R49.1 U9.6(SCLK)
NetR50_1: R50.1 U9.5(DOUT)

### Channels
CH1_I_ADC: designators end in _CH1_I_ADC; ports CLK=NetR47_CH1_I_ADC_2 DOUT=NetR50_CH1_I_ADC_2 SCLK=NetR49_CH1_I_ADC_2 VIN=NetR11_CH1_MIXED_I_1
CH1_Q_ADC: designators end in _CH1_Q_ADC; ports CLK=NetR47_CH1_Q_ADC_2 DOUT=NetR50_CH1_Q_ADC_2 SCLK=NetR49_CH1_Q_ADC_2 VIN=NetR11_CH1_MIXER_Q_1
CH2_Q_ADC: designators end in _CH2_Q_ADC; ports CLK=NetR47_CH2_Q_ADC_2 DOUT=NetR50_CH2_Q_ADC_2 SCLK=NetR49_CH2_Q_ADC_2 VIN=NetR11_CH2_MIXED_I_1
CH2_I_ADC: designators end in _CH2_I_ADC; ports CLK=NetR47_CH2_I_ADC_2 DOUT=NetR50_CH2_I_ADC_2 SCLK=NetR49_CH2_I_ADC_2 VIN=NetR11_CH2_MIXER_Q_1

### Notes on the sheet
- (in symbol ADS1252) ADC; CTRL
- (in symbol OPA2350, part B) -; +
- (in symbol OPA2350, part C) -; +

### Library data of the parts
C3 C46 C48 = 0603 100nF (104) 10% 50V: 贴片电容; ComponentLink1Description: 供应商链接; ComponentLink1URL: http://www.szlcsc.com/product/details_15331.html; Package: 0603; Supplier: LC; SuppliersPartNumber: C14663
C47 C49 = 0603 10nF (103) 10% 50V: 贴片电容; ComponentLink1Description: 供应商链接; ComponentLink1URL: http://www.szlcsc.com/product/details_58143.html; Package: 0603; Supplier: LC; SuppliersPartNumber: C57112
R2 R47 R49 R50 = 0603 22Ω (22R0) 1%: 贴片电阻; ComponentLink1Description: 供应商链接; ComponentLink1URL: http://www.szlcsc.com/product/details_24078.html; Package: 0603; Supplier: LC; SuppliersPartNumber: C23345
R40 R46 R48 R51 = 0603 10KΩ (1002) 1%: 贴片电阻; ComponentLink1Description: 供应商链接; ComponentLink1URL: http://www.szlcsc.com/product/details_26547.html; Package: 0603; Supplier: LC; SuppliersPartNumber: C25804
U8 = OPA2350: 10MHz RRIO Zero-Drift 5.5V

## Sheet PCM1802_StereoADC.SchDoc
size A4; SheetNumber: 9; SheetTotal: 9
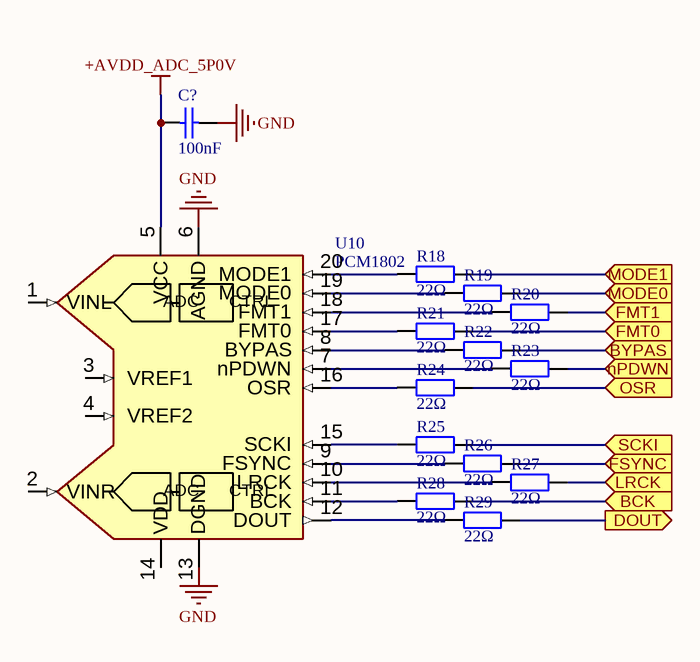
[diagram p8: PCM1802_StereoADC.SchDoc]

### Parts
C?  100nF  [0603_C]
R18  22Ω  [0603_R]
R19  22Ω  [0603_R]
R20  22Ω  [0603_R]
R21  22Ω  [0603_R]
R22  22Ω  [0603_R]
R23  22Ω  [0603_R]
R24  22Ω  [0603_R]
R25  22Ω  [0603_R]
R26  22Ω  [0603_R]
R27  22Ω  [0603_R]
R28  22Ω  [0603_R]
R29  22Ω  [0603_R]
U10  PCM1802  [SOP65P780X200-20N]

### Ports
BCK (in), BYPAS (in), DOUT (out), FMT0 (in), FMT1 (in), FSYNC (in), LRCK (in), MODE0 (in), MODE1 (in), nPDWN (in), OSR (in), SCKI (in)

### Nets
+AVDD_ADC_5P0V: C?.1 U10.5(VCC)
GND: C?.2 U10.6(AGND) U10.13(DGND)
NetR18_1: R18.1 U10.20(MODE1)
NetR18_2: R18.2 ; port MODE1
NetR19_1: R19.1 U10.19(MODE0)
NetR19_2: R19.2 ; port MODE0
NetR20_1: R20.1 U10.18(FMT1)
NetR20_2: R20.2 ; port FMT1
NetR21_1: R21.1 U10.17(FMT0)
NetR21_2: R21.2 ; port FMT0
NetR22_1: R22.1 U10.8(BYPAS)
NetR22_2: R22.2 ; port BYPAS
NetR23_1: R23.1 U10.7(nPDWN)
NetR23_2: R23.2 ; port nPDWN
NetR24_1: R24.1 U10.16(OSR)
NetR24_2: R24.2 ; port OSR
NetR25_1: R25.1 U10.15(SCKI)
NetR25_2: R25.2 ; port SCKI
NetR26_1: R26.1 U10.9(FSYNC)
NetR26_2: R26.2 ; port FSYNC
NetR27_1: R27.1 U10.10(LRCK)
NetR27_2: R27.2 ; port LRCK
NetR28_1: R28.1 U10.11(BCK)
NetR28_2: R28.2 ; port BCK
NetR29_1: R29.1 U10.12(DOUT)
NetR29_2: R29.2 ; port DOUT

Not connected (* = marked no-connect by the designer): U10 1(VINL) 2(VINR) 3(VREF1) 4(VREF2) 14(VDD)

### Notes on the sheet
- (in symbol PCM1802) ADC; CTRL

### Library data of the parts
C? = 0603 100nF (104) 10% 50V: 贴片电容; ComponentLink1Description: 供应商链接; ComponentLink1URL: http://www.szlcsc.com/product/details_15331.html; Package: 0603; Supplier: LC; SuppliersPartNumber: C14663
R18-R29 = 0603 22Ω (22R0) 1%: 贴片电阻; ComponentLink1Description: 供应商链接; ComponentLink1URL: http://www.szlcsc.com/product/details_24078.html; Package: 0603; Supplier: LC; SuppliersPartNumber: C23345

## Nets that join several sheets
+12: CH1/LNA1 (D5_CH1_LNA1.2 JK1_CH1_LNA1.1), CH1/ATTN1 (8 pins), CH2/LNA1 (D5_CH2_LNA1.2 JK1_CH2_LNA1.1), CH2/ATTN1 (8 pins)
+AVDD_5P5V: CH1_I_ADC (FB11_CH1_I_ADC.1), CH1_Q_ADC (FB11_CH1_Q_ADC.1), CH2_Q_ADC (FB11_CH2_Q_ADC.1), CH2_I_ADC (FB11_CH2_I_ADC.1)
+AVEE_5P5V: CH1_I_ADC (FB12_CH1_I_ADC.1), CH1_Q_ADC (FB12_CH1_Q_ADC.1), CH2_Q_ADC (FB12_CH2_Q_ADC.1), CH2_I_ADC (FB12_CH2_I_ADC.1)
+DVDD_3P3V: CH1/PGA1 (C43_CH1_PGA1.2 U6_CH1_PGA1.8), CH2/PGA1 (C43_CH2_PGA1.2 U6_CH2_PGA1.8)
+VDD_ADC_5P0V: CH1_I_ADC (C3_CH1_I_ADC.1 U9_CH1_I_ADC.3), CH1_Q_ADC (C3_CH1_Q_ADC.1 U9_CH1_Q_ADC.3), CH2_Q_ADC (C3_CH2_Q_ADC.1 U9_CH2_Q_ADC.3), CH2_I_ADC (C3_CH2_I_ADC.1 U9_CH2_I_ADC.3)
+VREF_2P5V: CH1/PGA1 (C44_CH1_PGA1.2 U6_CH1_PGA1.3), CH1_I_ADC (U8_CH1_I_ADC.3), CH1_Q_ADC (U8_CH1_Q_ADC.3), CH2/PGA1 (C44_CH2_PGA1.2 U6_CH2_PGA1.3), CH2_Q_ADC (U8_CH2_Q_ADC.3), CH2_I_ADC (U8_CH2_I_ADC.3)
AGND: Analog_Channel_Test (CH1.MH CH2.MH), CH1/LNA1 (R3_CH1_LNA1.1), CH2/LNA1 (R3_CH2_LNA1.1)
GND: CH1/LNA1 (9 pins), CH1/PGA1 (11 pins), CH1/MIXER_Q (13 pins), CH1/MIXED_I (13 pins), CH1/ATTN1 (5 pins), PWR_CH1 (20 pins), CH1_I_ADC (7 pins), CH1_Q_ADC (7 pins), CH2/LNA1 (9 pins), CH2/PGA1 (11 pins), CH2/MIXER_Q (13 pins), CH2/MIXED_I (13 pins), CH2/ATTN1 (5 pins), PWR_CH2 (20 pins), CH2_Q_ADC (7 pins), CH2_I_ADC (7 pins), PCM1802_StereoADC (C?.2 U10.6 U10.13)
NetC1_CH1_1: CH1 (C1_CH1.1), CH1/LNA1 (JK1_CH1_LNA1.6)
NetC1_CH1_2: CH1 (C1_CH1.2), CH1/PGA1 (U7_CH1_PGA1.3)
NetC1_CH2_1: CH2 (C1_CH2.1), CH2/LNA1 (JK1_CH2_LNA1.6)
NetC1_CH2_2: CH2 (C1_CH2.2), CH2/PGA1 (U7_CH2_PGA1.3)
NetC2_CH1_ATTN1_1: Analog_Channel_Test (CH1.1), CH1/ATTN1 (C2_CH1_ATTN1.1 JK5_CH1_ATTN1.3 JK5_CH1_ATTN1.6)
NetC2_CH2_ATTN1_1: Analog_Channel_Test (CH2.1), CH2/ATTN1 (C2_CH2_ATTN1.1 JK5_CH2_ATTN1.3 JK5_CH2_ATTN1.6)
NetC22_PWR_CH1_2: CH1/LNA1 (FB1_CH1_LNA1.1), CH1/PGA1 (FB5_CH1_PGA1.1), CH1/MIXER_Q (FB3_CH1_MIXER_Q.1), CH1/MIXED_I (FB3_CH1_MIXED_I.1), PWR_CH1 (C22_PWR_CH1.2 FB8_PWR_CH1.1)
NetC22_PWR_CH2_2: CH2/LNA1 (FB1_CH2_LNA1.1), CH2/PGA1 (FB5_CH2_PGA1.1), CH2/MIXER_Q (FB3_CH2_MIXER_Q.1), CH2/MIXED_I (FB3_CH2_MIXED_I.1), PWR_CH2 (C22_PWR_CH2.2 FB8_PWR_CH2.1)
NetC30_PWR_CH1_1: CH1/LNA1 (FB2_CH1_LNA1.1), CH1/PGA1 (FB6_CH1_PGA1.1), CH1/MIXER_Q (FB4_CH1_MIXER_Q.1), CH1/MIXED_I (FB4_CH1_MIXED_I.1), PWR_CH1 (C30_PWR_CH1.1 FB10_PWR_CH1.1)
NetC30_PWR_CH2_1: CH2/LNA1 (FB2_CH2_LNA1.1), CH2/PGA1 (FB6_CH2_PGA1.1), CH2/MIXER_Q (FB4_CH2_MIXER_Q.1), CH2/MIXED_I (FB4_CH2_MIXED_I.1), PWR_CH2 (C30_PWR_CH2.1 FB10_PWR_CH2.1)
NetC31_CH1_1: CH1 (C31_CH1.1 C32_CH1.1), CH1/PGA1 (R39_CH1_PGA1.2 U7_CH1_PGA1.7)
NetC31_CH1_2: CH1 (C31_CH1.2), CH1/MIXED_I (U2_CH1_MIXED_I.7)
NetC31_CH2_1: CH2 (C31_CH2.1 C32_CH2.1), CH2/PGA1 (R39_CH2_PGA1.2 U7_CH2_PGA1.7)
NetC31_CH2_2: CH2 (C31_CH2.2), CH2/MIXED_I (U2_CH2_MIXED_I.7)
NetC32_CH1_2: CH1 (C32_CH1.2), CH1/MIXER_Q (U2_CH1_MIXER_Q.7)
NetC32_CH2_2: CH2 (C32_CH2.2), CH2/MIXER_Q (U2_CH2_MIXER_Q.7)
NetJK1_CH1_LNA1_3: CH1/LNA1 (JK1_CH1_LNA1.3), CH1/ATTN1 (JK4_CH1_ATTN1.3)
NetJK1_CH2_LNA1_3: CH2/LNA1 (JK1_CH2_LNA1.3), CH2/ATTN1 (JK4_CH2_ATTN1.3)
NetR11_CH1_MIXED_I_1: CH1/MIXED_I (R11_CH1_MIXED_I.1 U3_CH1_MIXED_I.6), CH1_I_ADC (R48_CH1_I_ADC.1)
NetR11_CH1_MIXER_Q_1: CH1/MIXER_Q (R11_CH1_MIXER_Q.1 U3_CH1_MIXER_Q.6), CH1_Q_ADC (R48_CH1_Q_ADC.1)
NetR11_CH2_MIXED_I_1: CH2/MIXED_I (R11_CH2_MIXED_I.1 U3_CH2_MIXED_I.6), CH2_Q_ADC (R48_CH2_Q_ADC.1)
NetR11_CH2_MIXER_Q_1: CH2/MIXER_Q (R11_CH2_MIXER_Q.1 U3_CH2_MIXER_Q.6), CH2_I_ADC (R48_CH2_I_ADC.1)
NetU2_CH1_MIXED_I_1: CH1/MIXED_I (U2_CH1_MIXED_I.1), CH2/MIXED_I (U2_CH2_MIXED_I.1)
NetU2_CH1_MIXER_Q_1: CH1/MIXER_Q (U2_CH1_MIXER_Q.1), CH2/MIXER_Q (U2_CH2_MIXER_Q.1)